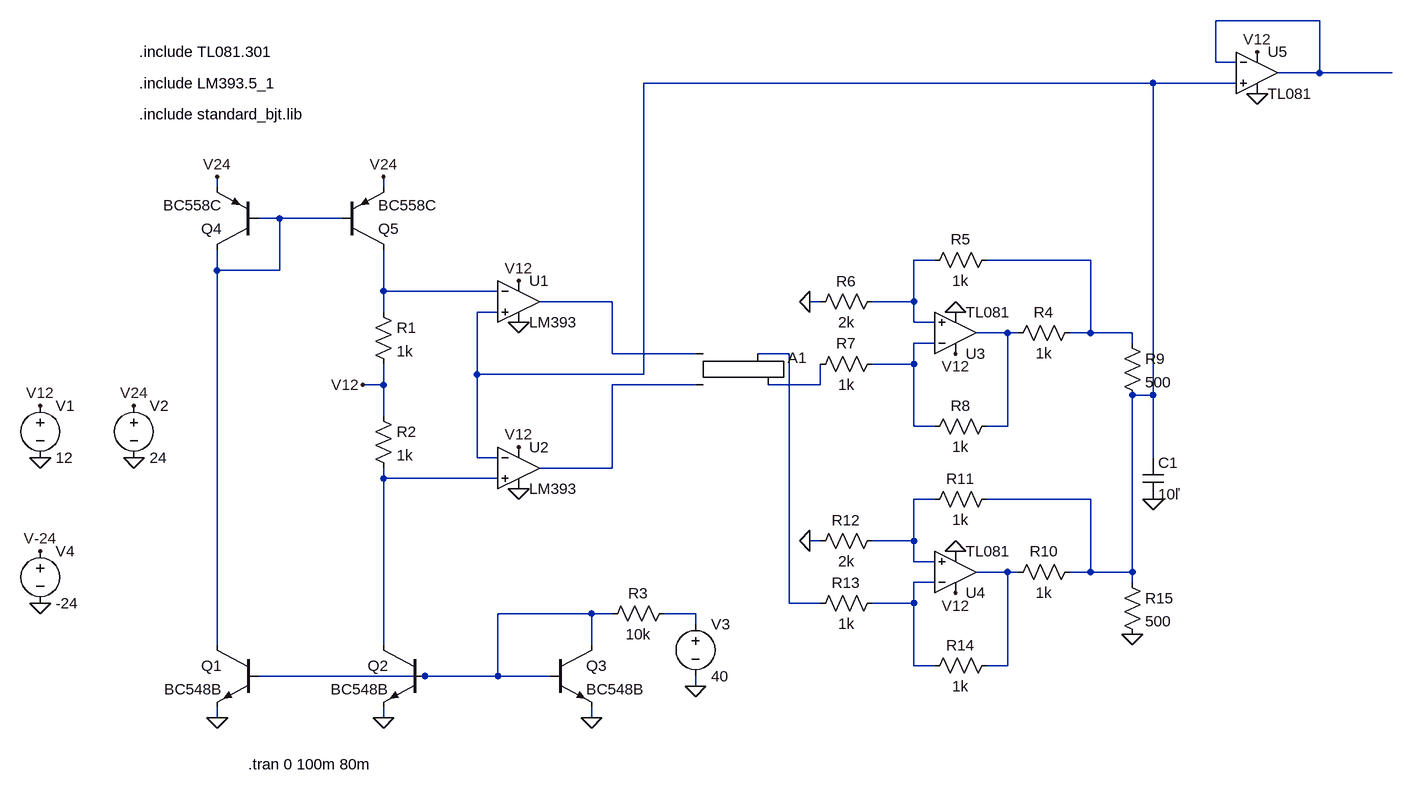
[diagram p0: schematic Gen_triangular_prueba2_Howland.asc]
Gen_triangular_prueba2_Howland.asc, the LTspice schematic file:
Version 4
SHEET 1 2312 680
WIRE 1824 -688 1664 -688
WIRE 1664 -624 1664 -688
WIRE 1696 -624 1664 -624
WIRE 1824 -608 1824 -688
WIRE 1824 -608 1760 -608
WIRE 1936 -608 1824 -608
WIRE 1568 -592 784 -592
WIRE 1696 -592 1568 -592
WIRE 128 -432 128 -448
WIRE 384 -432 384 -448
WIRE 224 -384 192 -384
WIRE 320 -384 224 -384
WIRE 1232 -320 1200 -320
WIRE 1472 -320 1312 -320
WIRE 128 -304 128 -336
WIRE 224 -304 224 -384
WIRE 224 -304 128 -304
WIRE 384 -272 384 -336
WIRE 560 -272 384 -272
WIRE 736 -256 624 -256
WIRE 1056 -256 1040 -256
WIRE 1200 -256 1200 -320
WIRE 1200 -256 1136 -256
WIRE 384 -240 384 -272
WIRE 560 -240 528 -240
WIRE 1200 -224 1200 -256
WIRE 1232 -224 1200 -224
WIRE 1344 -208 1296 -208
WIRE 1360 -208 1344 -208
WIRE 1472 -208 1472 -320
WIRE 1472 -208 1440 -208
WIRE 1536 -208 1472 -208
WIRE 1232 -192 1200 -192
WIRE 1536 -192 1536 -208
WIRE 736 -176 736 -256
WIRE 864 -176 736 -176
WIRE 1008 -176 960 -176
WIRE 1200 -160 1200 -192
WIRE 1200 -160 1136 -160
WIRE 528 -144 528 -240
WIRE 784 -144 784 -592
WIRE 784 -144 528 -144
WIRE 384 -128 384 -160
WIRE 384 -128 352 -128
WIRE 864 -128 736 -128
WIRE 1056 -128 1056 -160
WIRE 1056 -128 976 -128
WIRE 1568 -112 1568 -592
WIRE 1568 -112 1536 -112
WIRE 384 -80 384 -128
WIRE 1200 -64 1200 -160
WIRE 1232 -64 1200 -64
WIRE 1344 -64 1344 -208
WIRE 1344 -64 1312 -64
WIRE 528 -16 528 -144
WIRE 560 -16 528 -16
WIRE 1568 -16 1568 -112
WIRE 736 0 736 -128
WIRE 736 0 624 0
WIRE 384 16 384 0
WIRE 560 16 384 16
WIRE 1232 48 1200 48
WIRE 1472 48 1312 48
WIRE 1056 112 1040 112
WIRE 1200 112 1200 48
WIRE 1200 112 1136 112
WIRE 1200 144 1200 112
WIRE 1232 144 1200 144
WIRE 1344 160 1296 160
WIRE 1360 160 1344 160
WIRE 1472 160 1472 48
WIRE 1472 160 1440 160
WIRE 1536 160 1536 -112
WIRE 1536 160 1472 160
WIRE 1232 176 1200 176
WIRE 1536 176 1536 160
WIRE 1008 208 1008 -176
WIRE 1056 208 1008 208
WIRE 1200 208 1200 176
WIRE 1200 208 1136 208
WIRE 704 224 560 224
WIRE 736 224 704 224
WIRE 864 224 816 224
WIRE 864 240 864 224
WIRE 128 272 128 -304
WIRE 384 272 384 16
WIRE 704 272 704 224
WIRE 1200 304 1200 208
WIRE 1232 304 1200 304
WIRE 1344 304 1344 160
WIRE 1344 304 1312 304
WIRE 448 320 192 320
WIRE 560 320 560 224
WIRE 560 320 448 320
WIRE 640 320 560 320
WIRE 864 336 864 320
WIRE 128 384 128 368
WIRE 384 384 384 368
WIRE 704 384 704 368
FLAG 704 384 0
FLAG 384 384 0
FLAG 128 384 0
FLAG 864 336 0
FLAG -144 -16 0
FLAG 0 -16 0
FLAG 352 -128 V12
FLAG -144 -96 V12
FLAG 0 -96 V24
FLAG 384 -448 V24
FLAG 128 -448 V24
FLAG 1568 48 0
FLAG 592 -224 0
FLAG 592 32 0
FLAG 592 -288 V12
FLAG 592 -32 V12
FLAG 1728 -576 0
FLAG 1728 -640 V12
FLAG -144 208 0
FLAG -144 128 V-24
FLAG 1264 -176 V12
FLAG 1040 -256 0
FLAG 1264 -240 0
FLAG 1264 192 V12
FLAG 1040 112 0
FLAG 1264 128 0
FLAG 1536 256 0
SYMBOL npn 192 272 M0
SYMATTR InstName Q1
SYMATTR Value BC548B
SYMBOL npn 448 272 M0
SYMATTR InstName Q2
SYMATTR Value BC548B
SYMBOL npn 640 272 R0
SYMATTR InstName Q3
SYMATTR Value BC548B
SYMBOL pnp 192 -336 R180
SYMATTR InstName Q4
SYMATTR Value BC558C
SYMBOL pnp 320 -336 M180
SYMATTR InstName Q5
SYMATTR Value BC558C
SYMBOL res 368 -256 R0
SYMATTR InstName R1
SYMATTR Value 1k
SYMBOL res 368 -96 R0
SYMATTR InstName R2
SYMATTR Value 1k
SYMBOL res 832 208 R90
WINDOW 0 0 56 VBottom 2
WINDOW 3 32 56 VTop 2
SYMATTR InstName R3
SYMATTR Value 10k
SYMBOL voltage -144 -112 R0
WINDOW 123 0 0 Left 0
WINDOW 39 0 0 Left 0
SYMATTR InstName V1
SYMATTR Value 12
SYMBOL voltage 0 -112 R0
WINDOW 123 0 0 Left 0
WINDOW 39 0 0 Left 0
SYMATTR InstName V2
SYMATTR Value 24
SYMBOL voltage 864 224 R0
WINDOW 123 0 0 Left 0
WINDOW 39 0 0 Left 0
SYMATTR InstName V3
SYMATTR Value 40
SYMBOL Opamps\\opamp2 592 -320 R0
SYMATTR InstName U1
SYMATTR Value LM393
SYMBOL Opamps\\opamp2 592 -64 R0
SYMATTR InstName U2
SYMATTR Value LM393
SYMBOL Digital\\srflop 912 -224 R0
SYMATTR InstName A1
SYMBOL cap 1552 -16 R0
SYMATTR InstName C1
SYMATTR Value 10ľ
SYMBOL Opamps\\opamp2 1728 -672 R0
SYMATTR InstName U5
SYMATTR Value TL081
SYMBOL voltage -144 112 R0
WINDOW 123 0 0 Left 0
WINDOW 39 0 0 Left 0
SYMATTR InstName V4
SYMATTR Value -24
SYMBOL Opamps\\opamp2 1264 -144 M180
SYMATTR InstName U3
SYMATTR Value TL081
SYMBOL res 1456 -224 R90
WINDOW 0 0 56 VBottom 2
WINDOW 3 32 56 VTop 2
SYMATTR InstName R4
SYMATTR Value 1k
SYMBOL res 1328 -336 R90
WINDOW 0 0 56 VBottom 2
WINDOW 3 32 56 VTop 2
SYMATTR InstName R5
SYMATTR Value 1k
SYMBOL res 1152 -272 R90
WINDOW 0 0 56 VBottom 2
WINDOW 3 32 56 VTop 2
SYMATTR InstName R6
SYMATTR Value 2k
SYMBOL res 1152 -176 R90
WINDOW 0 0 56 VBottom 2
WINDOW 3 32 56 VTop 2
SYMATTR InstName R7
SYMATTR Value 1k
SYMBOL res 1328 -80 R90
WINDOW 0 0 56 VBottom 2
WINDOW 3 32 56 VTop 2
SYMATTR InstName R8
SYMATTR Value 1k
SYMBOL res 1520 -208 R0
SYMATTR InstName R9
SYMATTR Value 500
SYMBOL Opamps\\opamp2 1264 224 M180
SYMATTR InstName U4
SYMATTR Value TL081
SYMBOL res 1456 144 R90
WINDOW 0 0 56 VBottom 2
WINDOW 3 32 56 VTop 2
SYMATTR InstName R10
SYMATTR Value 1k
SYMBOL res 1328 32 R90
WINDOW 0 0 56 VBottom 2
WINDOW 3 32 56 VTop 2
SYMATTR InstName R11
SYMATTR Value 1k
SYMBOL res 1152 96 R90
WINDOW 0 0 56 VBottom 2
WINDOW 3 32 56 VTop 2
SYMATTR InstName R12
SYMATTR Value 2k
SYMBOL res 1152 192 R90
WINDOW 0 0 56 VBottom 2
WINDOW 3 32 56 VTop 2
SYMATTR InstName R13
SYMATTR Value 1k
SYMBOL res 1328 288 R90
WINDOW 0 0 56 VBottom 2
WINDOW 3 32 56 VTop 2
SYMATTR InstName R14
SYMATTR Value 1k
SYMBOL res 1520 160 R0
SYMATTR InstName R15
SYMATTR Value 500
TEXT 8 -544 Left 2 !.include standard_bjt.lib
TEXT 176 456 Left 2 !.tran 0 100m 80m
TEXT 8 -592 Left 2 !.include LM393.5_1
TEXT 8 -640 Left 2 !.include TL081.301

The netlist it stands for:
* Gen_triangular_prueba2_Howland.asc
Q1 N003 N017 0 0 BC548B
Q2 N013 N017 0 0 BC548B
Q3 N017 N017 0 0 BC548B
Q4 N003 N003 V24 0 BC558C
Q5 N006 N003 V24 0 BC558C
R1 N006 V12 1k
R2 V12 N013 1k
R3 N018 N017 10k
V1 V12 0 12
V2 V24 0 24
V3 N018 0 40
XU1 N002 N006 V12 0 N007 LM393  ; pins In+ In- V+ V- OUT
XU2 N013 N002 V12 0 N011 LM393  ; pins In+ In- V+ V- OUT
A1 N007 N011 0 0 0 N012 N010 0 SRFLOP
C1 N002 0 10ľ
XU5 N002 N001 V12 0 N001 TL081  ; pins In+ In- V+ V- OUT
V4 V-24 0 -24
XU3 N004 N009 V12 0 N008 TL081  ; pins In+ In- V+ V- OUT
R4 N005 N008 1k
R5 N005 N004 1k
R6 N004 0 2k
R7 N009 N012 1k
R8 N008 N009 1k
R9 N005 N002 500
XU4 N014 N016 V12 0 N015 TL081  ; pins In+ In- V+ V- OUT
R10 N002 N015 1k
R11 N002 N014 1k
R12 N014 0 2k
R13 N016 N010 1k
R14 N015 N016 1k
R15 N002 0 500
.model NPN NPN
.model PNP PNP
.lib standard.bjt
.include standard_bjt.lib
.tran 0 100m 80m
.include LM393.5_1
.include TL081.301
.backanno
.end